# EAGLE design Large Flash (EAGLE 7.6.0)
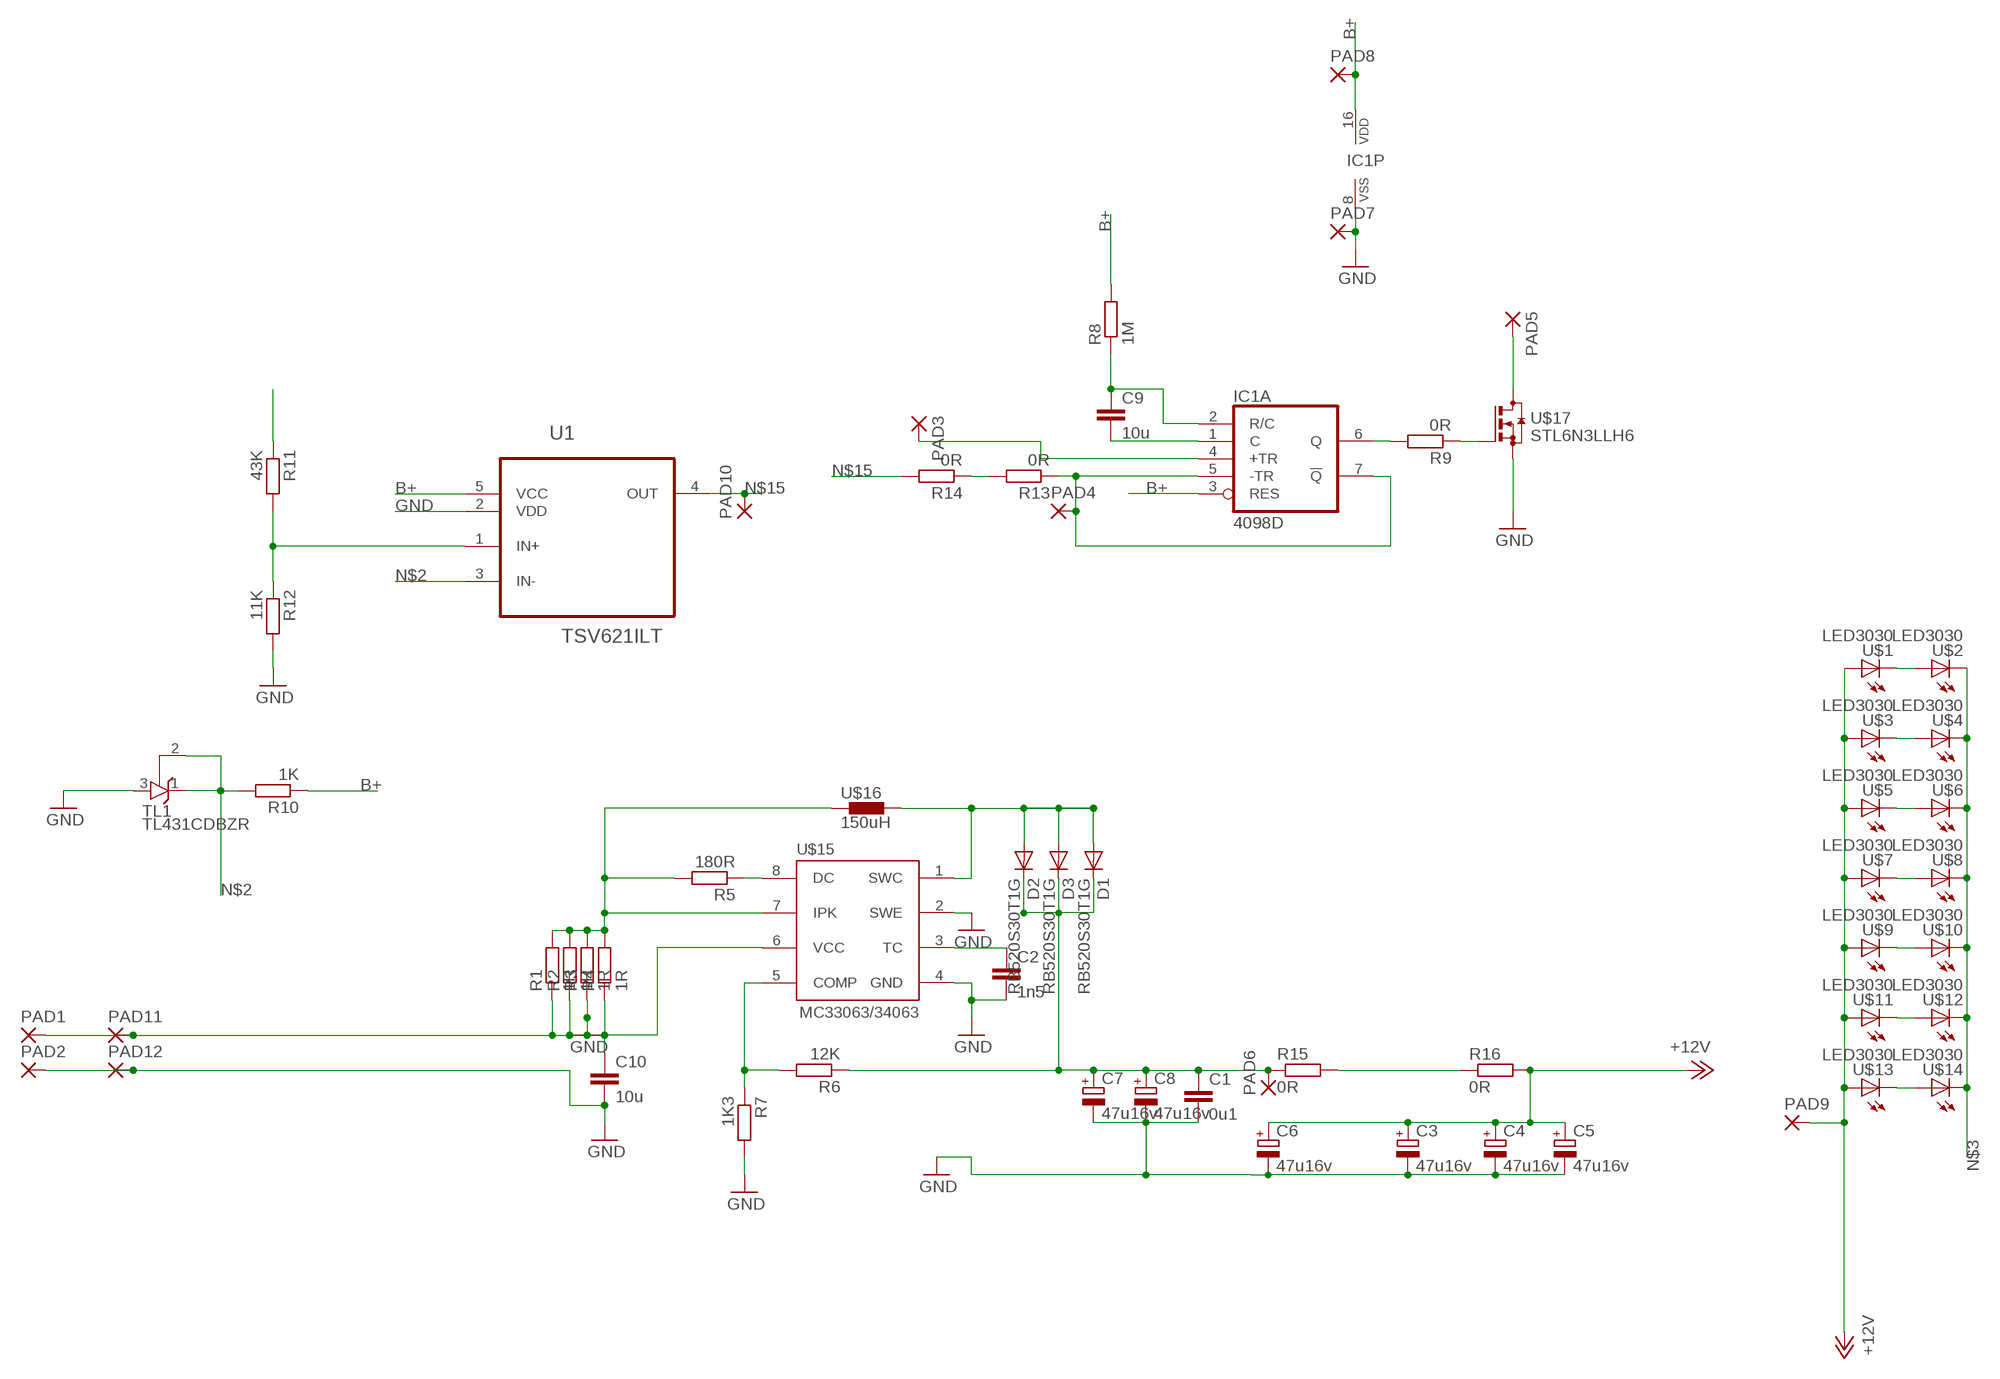
[diagram p0: schematic, sheet 1]

## Parts
C1  0u1  C-EUC0805  [C0805]
C2  1n5  C-EUC0805  [C0805]
C3  47u16v  CPOL-EU153CLV-0605  [153CLV-0605]
C4  47u16v  CPOL-EU153CLV-0605  [153CLV-0605]
C5  47u16v  CPOL-EU153CLV-0605  [153CLV-0605]
C6  47u16v  CPOL-EU153CLV-0605  [153CLV-0605]
C7  47u16v  CPOL-EU153CLV-0605  [153CLV-0605]
C8  47u16v  CPOL-EU153CLV-0605  [153CLV-0605]
C9  10u  C-EUC0805  [C0805]
C10  10u  C-EUC1206  [C1206]
D1  RB520S30T1G  DIODE-SOD523  [SOD523]
D2  RB520S30T1G  DIODE-SOD523  [SOD523]
D3  RB520S30T1G  DIODE-SOD523  [SOD523]
IC1  4098D  [SO16]
PAD1  SMD2  [SMD1,27-2,54]
PAD2  SMD2  [SMD1,27-2,54]
PAD3  SMD2  [SMD1,27-2,54]
PAD4  SMD2  [SMD1,27-2,54]
PAD5  SMD2  [SMD1,27-2,54]
PAD6  SMD2  [SMD1,27-2,54]
PAD7  SMD2  [SMD1,27-2,54]
PAD8  SMD2  [SMD1,27-2,54]
PAD9  SMD2  [SMD1,27-2,54]
PAD10  SMD2  [SMD1,27-2,54]
PAD11  SMD2  [SMD1,27-2,54]
PAD12  SMD2  [SMD1,27-2,54]
R1  1R  R-EU_R0805  [R0805]
R2  1R  R-EU_R0805  [R0805]
R3  1R  R-EU_R0805  [R0805]
R4  1R  R-EU_R0805  [R0805]
R5  180R  R-EU_R0805  [R0805]
R6  12K  R-EU_R0805  [R0805]
R7  1K3  R-EU_R0805  [R0805]
R8  1M  R-EU_R0805  [R0805]
R9  0R  R-EU_R0805  [R0805]
R10  1K  R-EU_R0805  [R0805]
R11  43K  R-EU_R0805  [R0805]
R12  11K  R-EU_R0805  [R0805]
R13  0R  R-EU_R0805  [R0805]
R14  0R  R-EU_R0805  [R0805]
R15  0R  R-EU_R0805  [R0805]
R16  0R  R-EU_R0805  [R0805]
TL1  TL431CDBZR  [SOT23]
U1  TSV621ILT  [SOT95P280X145-5N]
U$1  LED3030  [LED3030]
U$2  LED3030  [LED3030]
U$3  LED3030  [LED3030]
U$4  LED3030  [LED3030]
U$5  LED3030  [LED3030]
U$6  LED3030  [LED3030]
U$7  LED3030  [LED3030]
U$8  LED3030  [LED3030]
U$9  LED3030  [LED3030]
U$10  LED3030  [LED3030]
U$11  LED3030  [LED3030]
U$12  LED3030  [LED3030]
U$13  LED3030  [LED3030]
U$14  LED3030  [LED3030]
U$15  MC33063/MC34063D  [SO08]
U$16  150uH  INDUCTOR6045  [L6045]
U$17  STL6N3LLH6  [POWERFLAT-2X2]

## Nets
+12V: C3.+ C4.+ C5.+ C6.+ PAD9.1(P) R16.2 U$1.P$1(A) U$3.P$1(A) U$5.P$1(A) U$7.P$1(A) U$9.P$1(A) U$11.P$1(A) U$13.P$1(A)
B+: C10.1 IC1.3(A:RES) IC1.16(P:VDD) PAD1.1(P) PAD8.1(P) PAD11.1(P) R1.1 R2.1 R3.1 R4.1 R8.2 R10.1 U1.5(VCC) U$15.6(VCC) ; supply symbol labelled GND
GND: C1.2 C2.2 C3.- C4.- C5.- C6.- C7.- C8.- C10.2 IC1.8(P:VSS) PAD2.1(P) PAD7.1(P) PAD12.1(P) R7.2 R12.2 TL1.3(A) U1.2(VDD) U$15.2(SWE) U$15.4(GND) U$17.S U$17.S4(S)
N$1: U$1.P$2(C) U$2.P$1(A)
N$2: R10.2 TL1.1(C) TL1.2(R) U1.3(IN-)
N$3: PAD5.1(P) U$2.P$2(C) U$4.P$2(C) U$6.P$2(C) U$8.P$2(C) U$10.P$2(C) U$12.P$2(C) U$14.P$2(C) U$17.D U$17.D1(D) U$17.D2(D) U$17.D5(D) U$17.D6(D)
N$4: U$3.P$2(C) U$4.P$1(A)
N$5: R11.2 R12.1 U1.1(IN+)
N$6: IC1.4(A:+TR) PAD3.1(P)
N$7: U$5.P$2(C) U$6.P$1(A)
N$8: R1.2 R2.2 R3.2 R4.2 R5.2 U$15.7(IPK) U$16.P$1
N$9: R5.1 U$15.8(DC)
N$10: U$7.P$2(C) U$8.P$1(A)
N$11: R6.2 R7.1 U$15.5(COMP)
N$12: D1.A D2.A D3.A U$15.1(SWC) U$16.P$2
N$13: U$9.P$2(C) U$10.P$1(A)
N$14: C2.1 U$15.3(TC)
N$15: PAD10.1(P) R14.2 U1.4(OUT)
N$16: U$11.P$2(C) U$12.P$1(A)
N$17: C9.2 IC1.1(A:C)
N$18: C9.1 IC1.2(A:R/C) R8.1
N$19: U$13.P$2(C) U$14.P$1(A)
N$20: IC1.6(A:Q) R9.2
N$21: R9.1 U$17.G3(G)
N$22: R13.2 R14.1
N$23: C1.1 C7.+ C8.+ D1.C D2.C D3.C PAD6.1(P) R6.1 R11.1 R15.1
N$24: R15.2 R16.1
TR-: IC1.5(A:-TR) IC1.7(A:!Q) PAD4.1(P) R13.1
Unconnected: IC1.9(B:!Q) IC1.10(B:Q) IC1.11(B:-TR) IC1.12(B:+TR) IC1.13(B:RES) IC1.14(B:R/C) IC1.15(B:C)

## Library data of the parts
C1 C2 C9 C10 = rcl:C-EU: CAPACITOR, European symbol
C3-C8 = rcl:CPOL-EU: POLARIZED CAPACITOR, European symbol
D1-D3 = diode:DIODE-: DIODE
IC1 = 40xx:4098: Dual monostable MULTIVIBRATOR Source: Texas Instruments (Data sheet acquired frm Harris Semiconductor SCHS065) http://pdf1.alldatasheet.com/datasheet-pdf/view/26897/TI/CD4098.html
PAD1-PAD12 = wirepad:SMD2: SMD PAD
R1-R16 = rcl:R-EU_: RESISTOR, European symbol
TL1 = Namenlos:TL431
U1 = ST Microelctronics_By_element14_Batch_1:TSV621ILT: operational amplifiers; MPN: TSV621ILT; OC_FARNELL: 1737213; OC_NEWARK: 26R7211; PACKAGE: SOT-23-5; SUPPLIER: STMICROELECTRONICS
U$1-U$14 = Namenlos:LED3030
U$15 = Namenlos at:MC33063/MC34063: MC33063 and MC34063 Basic DC/DC converter with internal power-NPN transistor, 100KHz, 1.5A peak switch current. 3-40 input/output.
U$16 = Namenlos:INDUCTOR
U$17 = Namenlos:STL6N3LLH6

## Board
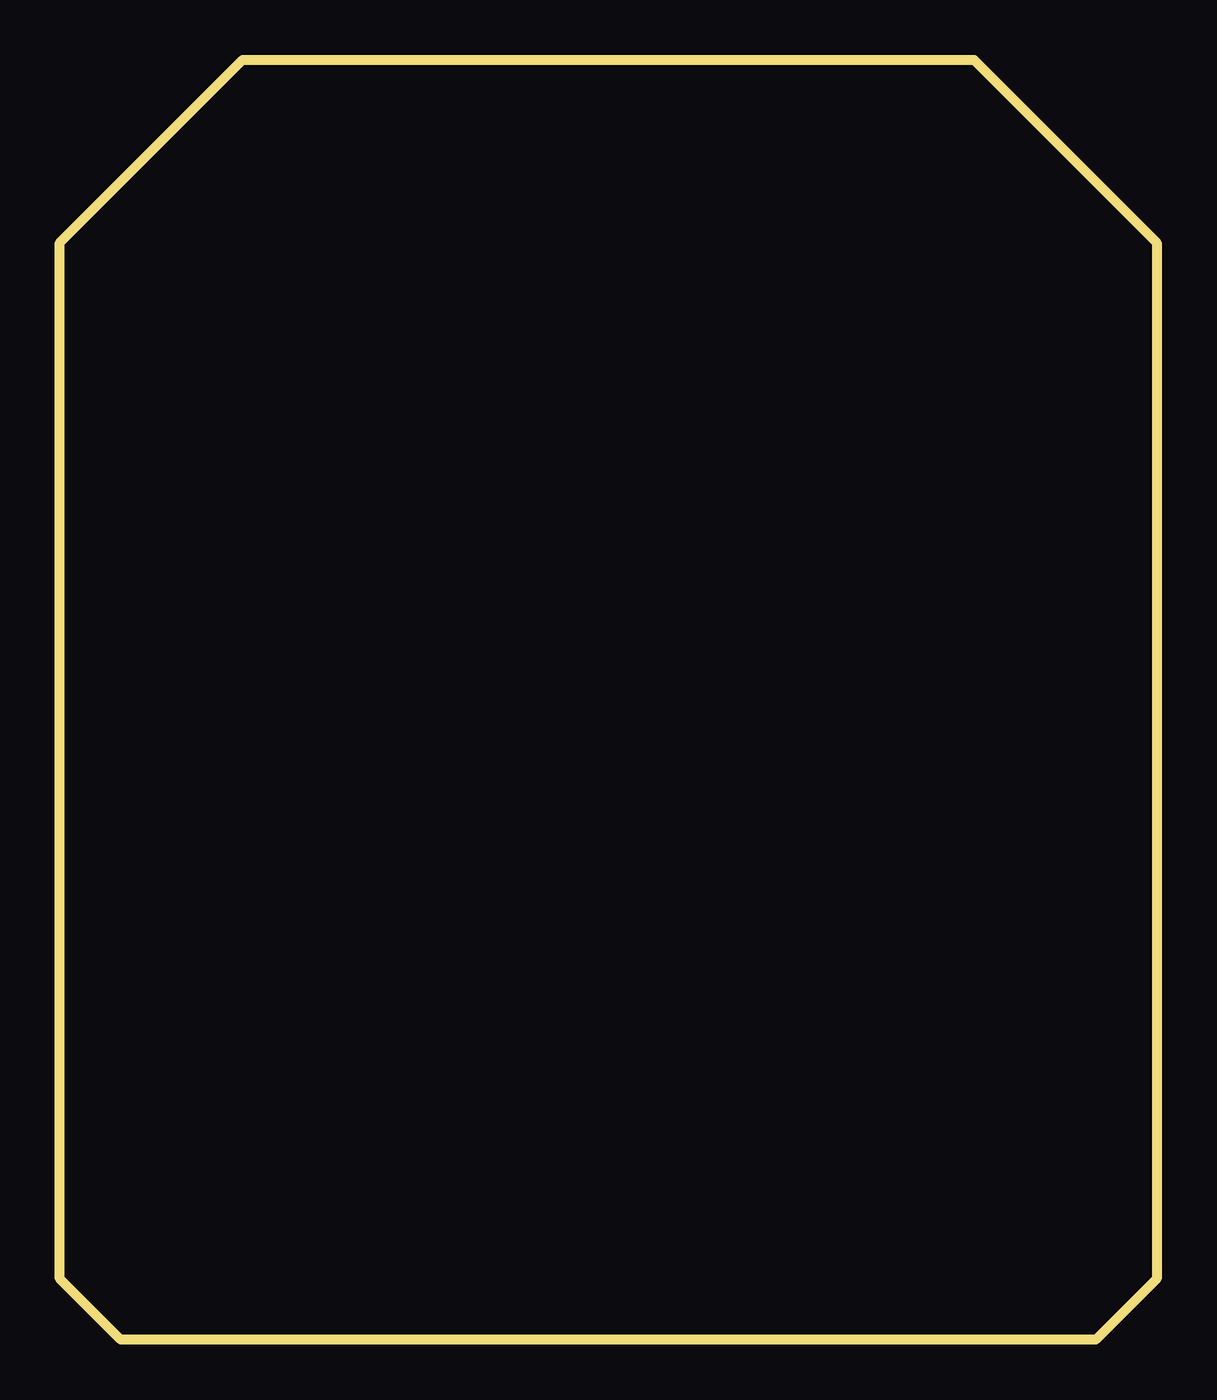
[diagram p1: board, top side]
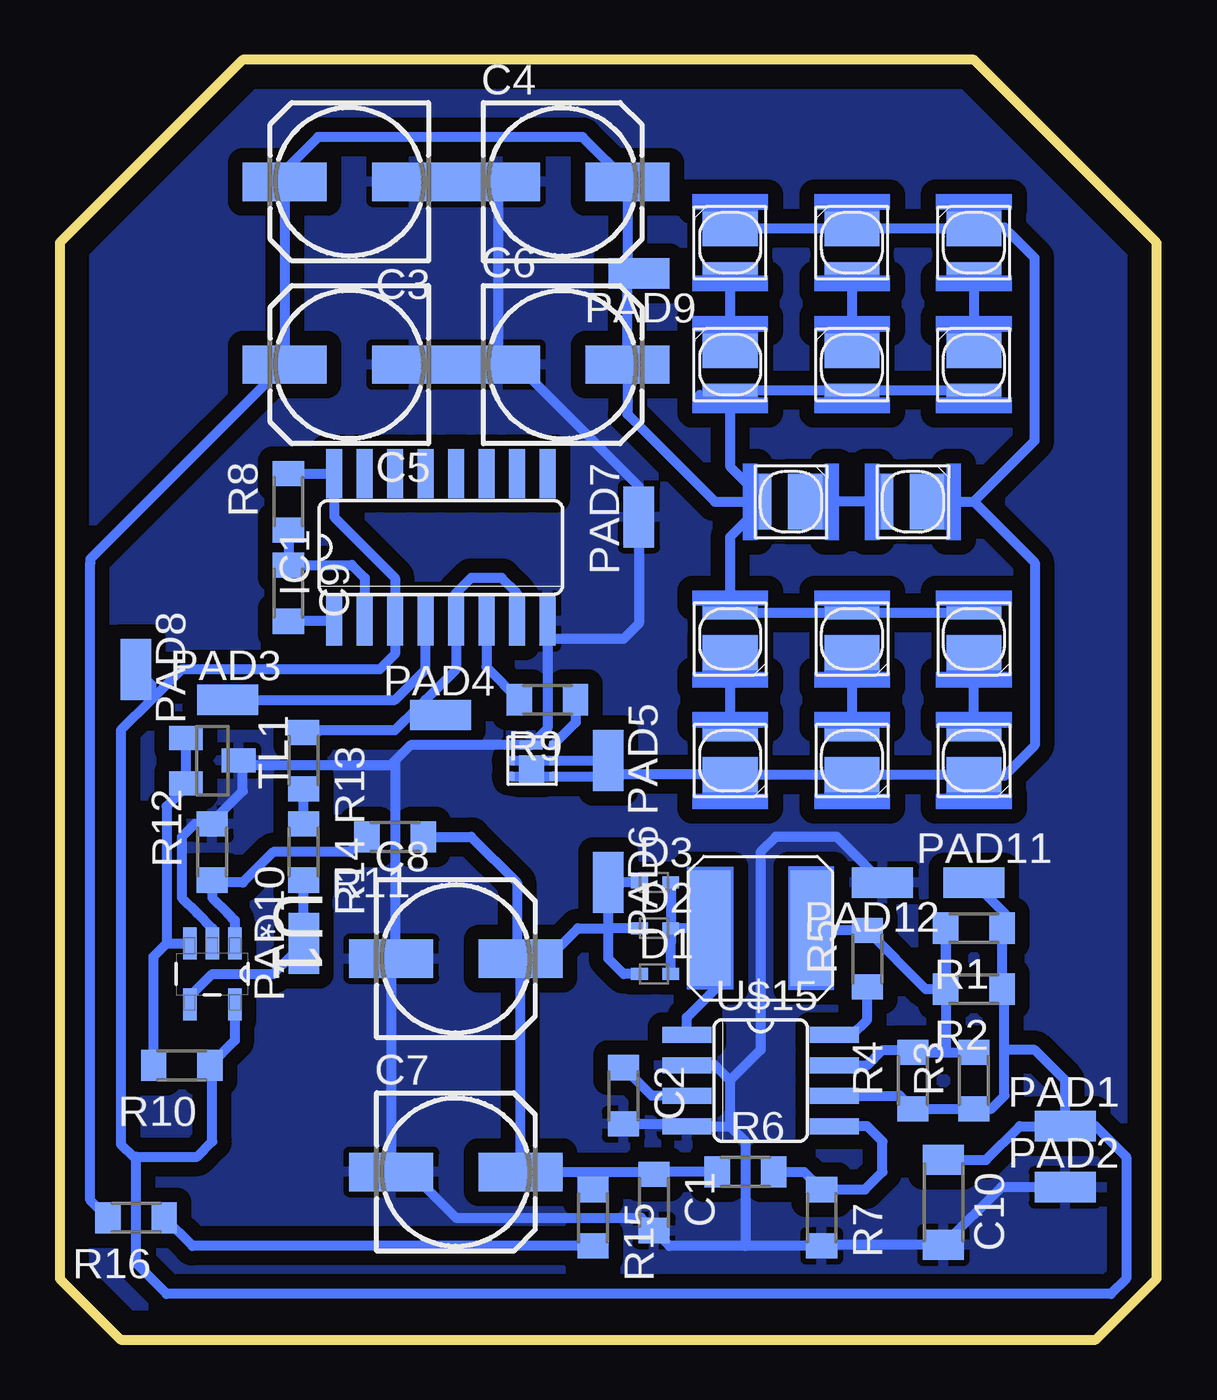
[diagram p2: board, bottom side, seen from below]

Size 45.72 x 53.34 mm. Coordinates in mm from the lower left corner, seen from the top.
Outline: 7.62,53.34 38.1,53.34 45.72,45.72 45.72,2.54 43.18,0 2.54,0 0,2.54 0,45.72 7.62,53.34
Copper layers (1*16): Top 0.035mm / dielectric 1.5mm / Bottom 0.035mm
Design rules "default": minimum track width 10mil, minimum drill 24mil, track to track 8mil, track to pad 8mil, pad to pad 8mil, via to via 8mil, smd to smd 8mil, copper to edge 40mil, drill to drill 8mil, minimum pad ring 10mil, minimum via ring 8mil, stop-mask expansion 4mil, vias tented up to drill 0mil, thermal gap 10mil

### Footprints (pad centres in the part's own frame; a part is rotated, then mirrored left to right if it is on the bottom)
C0805 = smd 1.05 x 1.3: 1 -1.175,0; 2 1.175,0
153CLV-0605 = smd 3.5 x 1.6: + 2.7,0; - -2.7,0
C1206 = smd 1.25 x 1.7: 1 -1.775,0; 2 1.775,0
SOD523 = smd 0.7 x 0.5: A 0.7,0; C -0.6,0
SO16 = smd 0.66 x 2.032: 1 -4.445,-3.073; 2 -3.175,-3.073; 3 -1.905,-3.073; 4 -0.635,-3.073; 5 0.635,-3.073; 6 1.905,-3.073; 7 3.175,-3.073; 8 4.445,-3.073; 9 4.445,3.073; 10 3.175,3.073; 11 1.905,3.073; 12 0.635,3.073; 13 -0.635,3.073; 14 -1.905,3.073; 15 -3.175,3.073; 16 -4.445,3.073
SMD1,27-2,54 = smd 1.27 x 2.54: 1 0,0
R0805 = smd 1.05 x 1.3: 1 -1.175,0; 2 1.175,0
SOT23 = smd 1 x 1.4: 1 -0.95,-1.1; 2 0.95,-1.1; 3 0,1.1
SOT95P280X145-5N = smd 1.321 x 0.559: 1 -1.27,0.94; 2 -1.27,0; 3 -1.27,-0.94; 4 1.27,-0.94; 5 1.27,0.94
LED3030 = smd 0.48 x 2.27: P$1 -1.075,0 | smd 1.43 x 2.27: P$2 0.58,0
SO08 = smd 0.66 x 2.032: 1 -1.905,-3.073; 2 -0.635,-3.073; 3 0.635,-3.073; 4 1.905,-3.073; 5 1.905,3.073; 6 0.635,3.073; 7 -0.635,3.073; 8 -1.905,3.073
L6045 = smd 1.7 x 4.8: P$1 -2.1,0; P$2 2.1,0
POWERFLAT-2X2 = smd 1.125 x 1.05: D -0.34,0.028 | smd 0.35 x 0.3: D1 -0.65,-0.875; D2 0,-0.875; D5 0,0.875; D6 -0.65,0.875; G3 0.65,-0.875; S4 0.65,0.875 | smd 0.35 x 0.95: S 0.65,0.05

### Placement (x,y rotation side)
C1  20.96,5.72 270 bottom
C2  22.23,10.16 270 bottom
C3  33.66,48.26 180 bottom
C4  24.77,48.26 0 bottom
C5  33.66,40.64 180 bottom
C6  24.77,40.64 0 bottom
C7  29.21,6.99 0 bottom
C8  29.21,15.88 0 bottom
C9  36.2,31.12 270 bottom
C10  8.89,5.72 270 bottom
D1  20.96,15.24 0 bottom
D2  20.96,17.15 0 bottom
D3  20.96,19.05 0 bottom
IC1  29.84,33.02 0 bottom
PAD1  3.81,8.89 270 bottom
PAD2  3.81,6.35 270 bottom
PAD3  38.73,26.67 270 bottom
PAD4  29.84,26.04 270 bottom
PAD5  22.86,24.13 180 bottom
PAD6  22.86,19.05 180 bottom
PAD7  21.59,34.29 0 bottom
PAD8  42.55,27.94 180 bottom
PAD9  21.59,44.45 90 bottom
PAD10  35.56,16.51 0 bottom
PAD11  7.62,19.05 270 bottom
PAD12  11.43,19.05 90 bottom
R1  7.62,17.15 180 bottom
R2  7.62,14.61 180 bottom
R3  7.62,10.8 90 bottom
R4  10.16,10.8 90 bottom
R5  12.07,15.88 90 bottom
R6  17.15,6.99 0 bottom
R7  13.97,5.08 270 bottom
R8  36.2,34.93 90 bottom
R9  25.4,26.67 180 bottom
R10  40.64,11.43 180 bottom
R11  31.75,20.96 180 bottom
R12  39.37,20.32 90 bottom
R13  35.56,24.13 270 bottom
R14  35.56,20.32 270 bottom
R15  23.5,5.08 270 bottom
R16  42.55,5.08 180 bottom
TL1  39.37,24.13 270 bottom
U1  39.37,15.24 270 bottom
U$1  17.78,29.21 270 bottom
U$2  17.78,24.13 270 bottom
U$3  12.7,29.21 270 bottom
U$4  12.7,24.13 270 bottom
U$5  7.62,29.21 270 bottom
U$6  7.62,24.13 270 bottom
U$7  15.24,34.93 0 bottom
U$8  10.16,34.93 0 bottom
U$9  7.62,40.64 90 bottom
U$10  7.62,45.72 90 bottom
U$11  12.7,40.64 90 bottom
U$12  12.7,45.72 90 bottom
U$13  17.78,40.64 90 bottom
U$14  17.78,45.72 90 bottom
U$15  16.51,10.8 270 bottom
U$16  16.51,17.15 180 bottom
U$17  26.04,24.13 90 bottom

### Tracks (layer width: path | path; a pad name or v marks a point on that pad's centre or on a via)
+12V
  Bottom 0.406: U$9.P$1 U$11.P$1 U$13.P$1 | U$13.P$1 17.78,36.39 U$7.P$1 | U$7.P$1 17.78,33.46 U$1.P$1 U$3.P$1 U$5.P$1 | 19.05,39.37 17.98,39.37 U$13.P$1 | C4.+ 22.07,48.42 | C4.+ 22.07,44.93 PAD9.1 22.07,43.98 C6.+ 22.07,38.58 18.42,34.93 U$7.P$1 | C3.+ 36.36,47.62 | 36.36,47.62 C5.+ 42.55,34.45 44.45,32.55 44.45,32.39 44.45,5.81 R16.2 | C4.+ 23.94,50.13 34.96,50.13 36.2,48.9 36.2,47.79 36.36,47.62
B+
  Bottom 0.406: PAD11.1 6.35,17.78 6.35,17.24 R1.1 R2.1 6.35,14.51 6.35,12.07 | U$15.6 10.7,10.16 R4.1 R3.1 6.89,9.62 6.35,10.16 6.35,12.07 | PAD1.1 3.81,10.8 5.08,12.07 6.35,12.07 | C10.1 7.12,7.49 5.72,8.89 PAD1.1 | U1.5 38.43,12.47 R10.1 39.37,11.34 39.37,8.26 40.01,7.62 42.55,7.62 | R8.2 IC1.16 34.29,34.29 31.75,31.75 IC1.3 31.75,28.58 32.39,27.94 40.64,27.94 41.91,26.67 | 41.91,26.67 43.18,25.4 43.18,8.15 42.65,7.62 42.55,7.62 | PAD1.1 2.54,8.89 1.27,7.62 1.27,2.54 1.91,1.91 41.27,1.91 42.55,3.18 42.55,7.62 | PAD8.1 41.91,27.3 41.91,26.67
GND
  Bottom 0.406: PAD2.1 6.48,6.35 C10.2 13.94,3.94 R7.2 17.15,3.91 | 17.15,3.91 20.32,3.91 C1.2 21.5,5.08 29.21,5.08 31.12,6.99 C7.- | 17.78,8.89 U$15.4 19.68,8.99 C2.2 | 17.78,8.89 17.15,8.26 17.15,3.91 | U$15.2 18.42,11.43 17.78,10.8 | 17.78,10.8 17.78,8.89 | PAD12.1 13.34,20.96 15.88,20.96 16.51,20.32 16.51,12.07 17.78,10.8 | 38.1,23.96 38.1,22.86 39.37,21.59 R12.2 40.1,21.5 40.64,20.96 40.64,18.42 40.01,17.78 39.37,17.15 U1.2 | 38.1,23.96 TL1.3 38.1,24.3 | IC1.8 25.4,29.21 | 25.4,29.21 25.4,25.47 U$17.S U$17.S4 31.1,24.78 31.75,24.13 | 31.75,24.13 31.75,16.04 C8.- C7.- | 38.1,23.96 31.92,23.96 31.75,24.13 | 25.4,29.21 22.23,29.21 21.59,29.85 PAD7.1 21.59,35.56 26.67,40.64 C6.- | C7.- 32.39,6.99 | C6.- C4.- C3.- | C6.- C5.-
  pour Bottom (isolate 0.61): 2.54,0 0,2.54 0,45.72 7.62,53.34 38.1,53.34 45.72,45.72 45.72,2.54 43.18,0
N$1
  Bottom 0.406: U$1.P$2 U$2.P$1
N$2
  Bottom 0.406: R10.2 41.81,15.97 41.27,16.51 | 41.27,16.51 U1.3 | TL1.1 TL1.2 40.47,23.03 41.27,22.23 41.27,16.51
N$3
  Bottom 0.406: U$14.P$2 U$12.P$2 U$10.P$2 7.57,46.36 6.35,46.36 5.08,45.09 5.08,37.47 7.62,34.93 | U$8.P$2 7.62,34.93 | 7.62,34.93 5.08,32.39 5.08,24.77 6.35,23.5 7.57,23.5 U$6.P$2 U$4.P$2 U$2.P$2 22.8,23.55 22.88,23.48 | U$17.D5 U$17.D2 PAD5.1 22.86,23.5 22.88,23.48 | U$17.D6 26.04,23.48 | 26.04,23.48 U$17.D1 22.88,23.48 | U$17.D 26.06,23.51 26.04,23.48
N$4
  Bottom 0.406: U$3.P$2 U$4.P$1
N$5
  Bottom 0.406: R12.1 39.37,18.42 38.73,17.78 38.43,17.48 U1.1 38.34,16.42 | 39.27,19.05 R12.1 | R11.2 33.02,20.96 33.66,20.32 36.83,20.32 38.1,19.05 39.27,19.05 | 39.27,19.05 R12.1
N$6
  Bottom 0.406: PAD3.1 31.75,26.67 30.48,27.94 IC1.4
N$7
  Bottom 0.406: U$6.P$1 U$5.P$2
N$8
  Bottom 0.406: 11.97,17.15 R5.2 | R5.2 14.32,17.05 U$16.P$1 | U$15.7 12.07,11.43 11.43,12.07 10.26,12.07 R4.2 8.89,11.97 | 8.89,11.97 R3.2 | 8.89,11.97 8.8,12.07 R2.2 R1.2 8.8,14.7 8.89,14.61 9.62,14.61 R5.2
N$9
  Bottom 0.406: U$15.8 12.7,12.7 12.07,13.34 R5.1
N$10
  Bottom 0.406: U$8.P$1 U$7.P$2
N$11
  Bottom 0.406: U$15.5 12.07,8.89 11.43,8.26 11.43,6.99 12.16,6.26 R7.1 14.7,6.99 R6.2
N$12
  Bottom 0.406: D1.A 20.26,16.51 | 20.26,16.51 D2.A | D3.A D2.A | D2.A U$16.P$2 18.42,16.95 18.42,14.61 19.58,13.44 U$15.1 | D2.A 20.26,16.51
N$13
  Bottom 0.406: U$10.P$1 U$9.P$2
N$14
  Bottom 0.406: U$15.3 21.05,10.16 C2.1
N$15
  Bottom 0.406: U1.4 40.31,14.3 39.37,15.24 36.83,15.24 PAD10.1 R14.2
N$16
  Bottom 0.406: U$12.P$1 U$11.P$2
N$17
  Bottom 0.406: IC1.1 C9.2
N$18
  Bottom 0.406: IC1.2 33.02,31.75 33.56,32.29 C9.1 R8.1
N$19
  Bottom 0.406: U$14.P$1 U$13.P$2
N$20
  Bottom 0.406: IC1.6 27.94,28.04 R9.2
N$21
  Bottom 0.406: R9.1 24.23,25.72 U$17.G3
N$22
  Bottom 0.406: R14.1 R13.2
N$23
  Bottom 0.406: PAD6.1 D3.C PAD6.1 | D2.C 22.86,17.15 | 22.86,17.15 PAD6.1 | D1.C 22.23,15.24 22.86,15.88 22.86,17.15 | C8.+ C7.+ 24.13,6.99 | C8.+ 25.4,15.88 24.13,17.15 22.86,17.15 | 20.86,6.99 C1.1 | 24.13,6.99 21.05,6.99 C1.1 | R15.1 23.5,6.35 24.13,6.99 | R6.1 20.86,6.99 | 20.86,6.99 C1.1 | R11.1 28.58,20.96 26.67,19.05 26.67,16.04 C8.+
N$24
  Bottom 0.406: R15.2 40.2,3.91 R16.1
TR-
  Bottom 0.406: IC1.7 26.67,31.12 27.3,31.75 28.58,31.75 29.21,31.12 IC1.5 29.21,27.94 30.48,26.67 | 30.48,26.67 30.8,26.35 31.75,25.4 34.93,25.4 35.02,25.3 R13.1 | PAD4.1 30.48,26.67